# Altium schematic sheet LEDCube.schdoc
size 288 x 174 mm
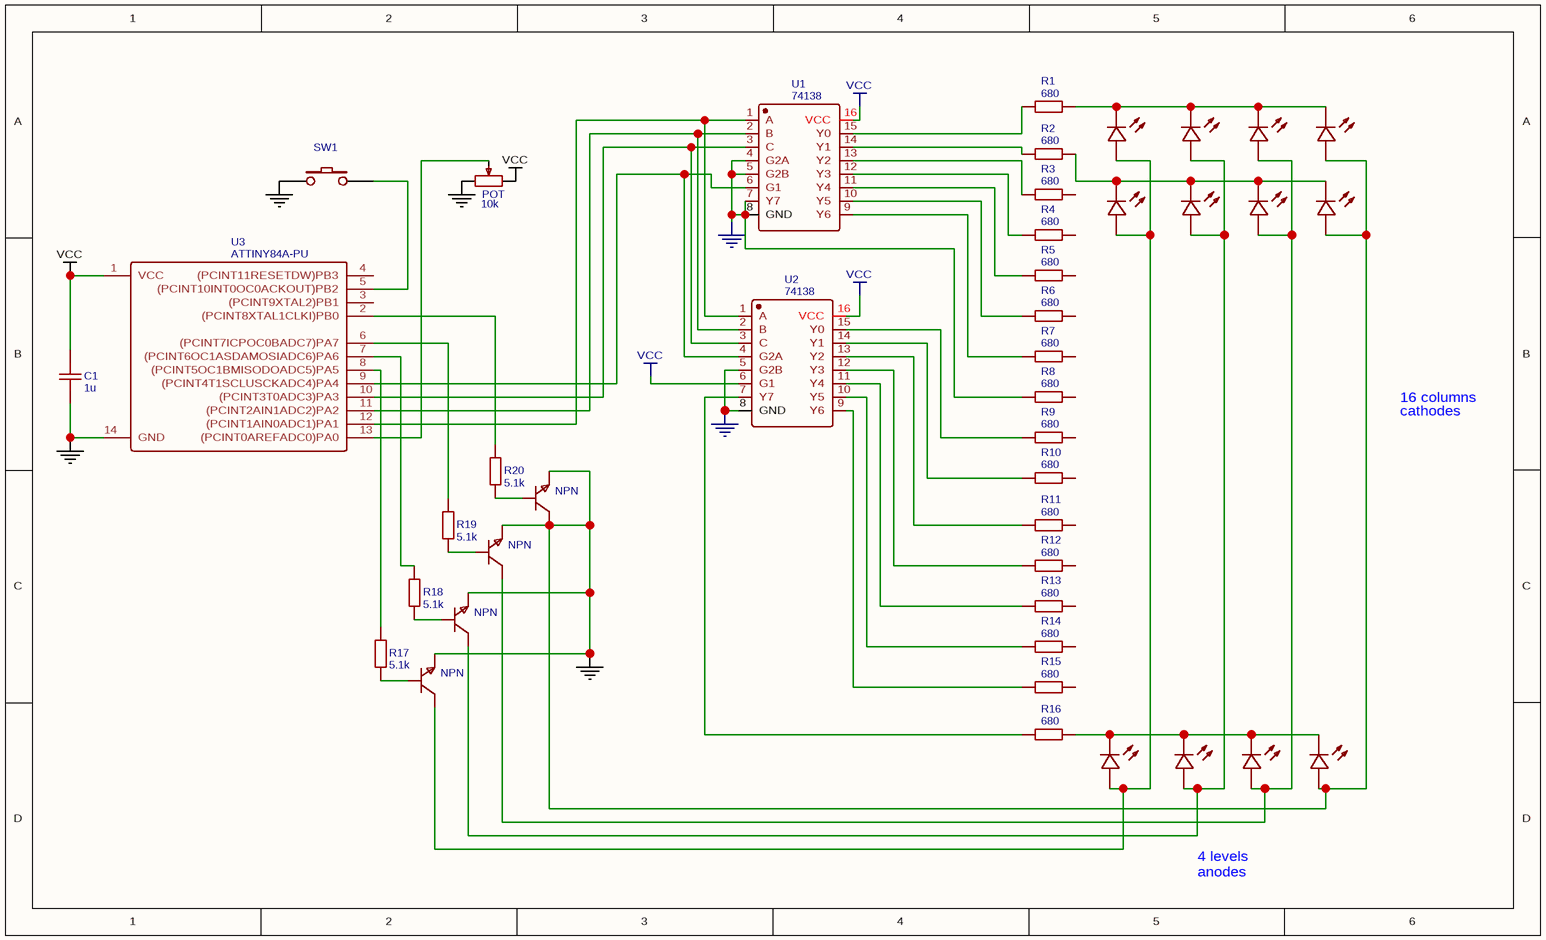
[diagram p0: LEDCube.schdoc]

## Parts
(Parts that share a designator on the sheet are numbered #1, #2 ... from top to bottom, then left to right.)
C1  1u  [RAD-0.1]
LED1  LED1  [LED-5MM/2.54]  (value not drawn)
LED2  LED1  [LED-5MM/2.54]  (value not drawn)
LED3  LED1  [LED-5MM/2.54]  (value not drawn)
LED4  LED1  [LED-5MM/2.54]  (value not drawn)
LED5  LED1  [LED-5MM/2.54]  (value not drawn)
LED6  LED1  [LED-5MM/2.54]  (value not drawn)
LED7  LED1  [LED-5MM/2.54]  (value not drawn)
LED8  LED1  [LED-5MM/2.54]  (value not drawn)
LED9  LED1  [LED-5MM/2.54]  (value not drawn)
LED10  LED1  [LED-5MM/2.54]  (value not drawn)
LED11  LED1  [LED-5MM/2.54]  (value not drawn)
LED12  LED1  [LED-5MM/2.54]  (value not drawn)
NPN#1  NPN  [SOT-23(SOT-23-3)F]  (value not drawn)
NPN#2  NPN  [SOT-23(SOT-23-3)F]  (value not drawn)
NPN#3  NPN  [SOT-23(SOT-23-3)F]  (value not drawn)
NPN#4  NPN  [SOT-23(SOT-23-3)F]  (value not drawn)
POT  10k  [RES-ADJ_3386P]
R1  680  [2512]
R2  680  [2512]
R3  680  [2512]
R4  680  [2512]
R5  680  [2512]
R6  680  [2512]
R7  680  [2512]
R8  680  [2512]
R9  680  [2512]
R10  680  [2512]
R11  680  [2512]
R12  680  [2512]
R13  680  [2512]
R14  680  [2512]
R15  680  [2512]
R16  680  [2512]
R17  5.1k  [AXIAL-0.3]
R18  5.1k  [AXIAL-0.3]
R19  5.1k  [AXIAL-0.3]
R20  5.1k  [AXIAL-0.3]
SW1  EVQ22705R  [KEY-6.0*6.0-4]  (value not drawn)
U1  74138  [DIP16]
U2  74138  [DIP16]
U3  ATTINY84A-PU  [DIP-14]

## Nets
GND: C1.1 LED4.1(+) LED8.1(+) LED12.1(+) NPN#1.1(E) NPN#1.3(C) NPN#2.1(E) NPN#3.1(E) NPN#4.1(E) POT.3 R8.1 SW1.1 U1.4(G2A) U1.5(G2B) U1.6(G1) U1.7(Y7) U1.8(GND) U2.4(G2A) U2.5(G2B) U2.8(GND) U3.9((PCINT4T1SCLUSCKADC4)PA4) U3.14(GND)
VCC: C1.2 POT.1 U1.16(VCC) U2.6(G1) U2.16(VCC) U3.1(VCC)
NetLED1_1: LED1.1(+) LED6.1(+) LED10.1(+) NPN#3.3(C)
NetLED1_2: LED1.2(-) LED2.2(-) LED3.2(-) LED4.2(-) R1.2
NetLED2_1: LED2.1(+) LED5.1(+) LED9.1(+) NPN#4.3(C)
NetLED3_1: LED3.1(+) LED7.1(+) LED11.1(+) NPN#2.3(C)
NetLED5_2: LED5.2(-) LED6.2(-) LED7.2(-) LED8.2(-) R16.2
NetLED9_2: LED9.2(-) LED10.2(-) LED11.2(-) LED12.2(-) R2.2
NetNPN#1_2: NPN#1.2(B) R20.2
NetNPN#2_2: NPN#2.2(B) R19.2
NetNPN#3_2: NPN#3.2(B) R18.2
NetNPN#4_2: NPN#4.2(B) R17.2
NetPOT_2: POT.2 U3.13((PCINT0AREFADC0)PA0)
NetR1_1: R1.1 U1.15(Y0)
NetR2_1: R2.1 U1.14(Y1)
NetR3_1: R3.1 U1.13(Y2)
NetR4_1: R4.1 U1.12(Y3)
NetR5_1: R5.1 U1.11(Y4)
NetR6_1: R6.1 U1.10(Y5)
NetR7_1: R7.1 U1.9(Y6)
NetR9_1: R9.1 U2.15(Y0)
NetR10_1: R10.1 U2.14(Y1)
NetR11_1: R11.1 U2.13(Y2)
NetR12_1: R12.1 U2.12(Y3)
NetR13_1: R13.1 U2.11(Y4)
NetR14_1: R14.1 U2.10(Y5)
NetR15_1: R15.1 U2.9(Y6)
NetR16_1: R16.1 U2.7(Y7)
NetR17_1: R17.1 U3.8((PCINT5OC1BMISODOADC5)PA5)
NetR18_1: R18.1 U3.7((PCINT6OC1ASDAMOSIADC6)PA6)
NetR19_1: R19.1 U3.6((PCINT7ICPOC0BADC7)PA7)
NetR20_1: R20.1 U3.2((PCINT8XTAL1CLKI)PB0)
NetSW1_2: SW1.2 U3.5((PCINT10INT0OC0ACKOUT)PB2)
NetU1_1: U1.1(A) U2.1(A) U3.12((PCINT1AIN0ADC1)PA1)
NetU1_2: U1.2(B) U2.2(B) U3.11((PCINT2AIN1ADC2)PA2)
NetU1_3: U1.3(C) U2.3(C) U3.10((PCINT3T0ADC3)PA3)

Not connected (* = marked no-connect by the designer): R3 2; R4 2; R5 2; R6 2; R7 2; R8 2; R9 2; R10 2; R11 2; R12 2; R13 2; R14 2; R15 2; U3 3((PCINT9XTAL2)PB1) 4((PCINT11RESETDW)PB3)

## Notes on the sheet
- 16 columns
- cathodes
- 4 levels
- anodes

## Library data of the parts
C1 = (no symbol name): nameAlias: Value(F); BOM_Manufacturer Part: ?; spicePre: C; spiceSymbolName: Cap_RAD-0.1_US
LED1-LED12 = (no symbol name): BOM_Manufacturer: EVERLIGHT; BOM_Manufacturer Part: 5AR2ST10; BOM_Supplier: LCSC; BOM_LCSC: C52721; spicePre: L
NPN#1-NPN#4 = (no symbol name): BOM_Manufacturer: RENESAS; BOM_Manufacturer Part: 2SC3356-T1B-A; BOM_Supplier: LCSC; BOM_LCSC: C9659; BOM_LCSC Assembly: Yes; image: //image.lceda.cn/szlcsc/C9659.jpg; spicePre: Q
POT = (no symbol name): BOM_Manufacturer: Bochen; BOM_Manufacturer Part: 3386P-1-101LF; nameAlias: Resistance(Ohms); BOM_Supplier: LCSC; BOM_LCSC: C125022; spicePre: R; spiceSymbolName: 3386P-1-101LF
R1-R20 = (no symbol name): nameAlias: Value(Ω); BOM_Manufacturer Part: ?; spicePre: R
  R1-R16: spiceSymbolName: Resistor
  R17-R20: spiceSymbolName: Res_AXIAL-0.3(1/8W)_EU
SW1 = (no symbol name): BOM_Manufacturer: PANASONIC; Contributor: LCSC; BOM_Supplier: LCSC; BOM_LCSC: C79156; BOM_Manufacturer Part: EVQ22705R; spicePre: S
U3 = (no symbol name): BOM_Manufacturer: MICROCHIP; Contributor: LCSC; BOM_Supplier: LCSC; BOM_Manufacturer Part: ATTINY84A-PU; BOM_LCSC: C145560; spicePre: U
U1 U2 = (no symbol name): spicePre: X; BOM_Manufacturer Part: ?